# EAGLE schematic common emitter_se-punto di lavoro (EAGLE 9.6.2)
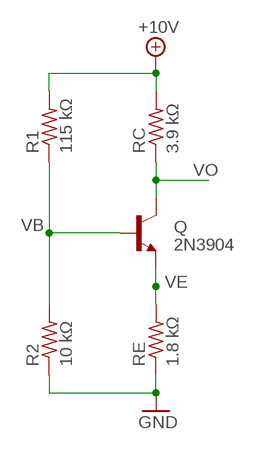
[diagram p0: schematic, sheet 1]

## Parts
Q  2N3904  [TO92]
R1  115 kΩ  R-US_0204/5  [0204/5]
R2  10 kΩ  R-US_0204/5  [0204/5]
RC  3.9 kΩ  R-US_0204/5  [0204/5]
RE  1.8 kΩ  R-US_0204/5  [0204/5]

## Nets
+10V: R1.2 RC.2
GND: R2.1 RE.1
VB: Q.2(B) R1.1 R2.2
VE: Q.3(E) RE.2
VO: Q.1(C) RC.1

## Library data of the parts
Q = transistor:2N3904: NPN TRANSISTOR
R1 R2 RC RE = rcl:R-US_: RESISTOR, American symbol; SPICEPREFIX: R